# Altium schematic sheet Usb.SchDoc
size A4
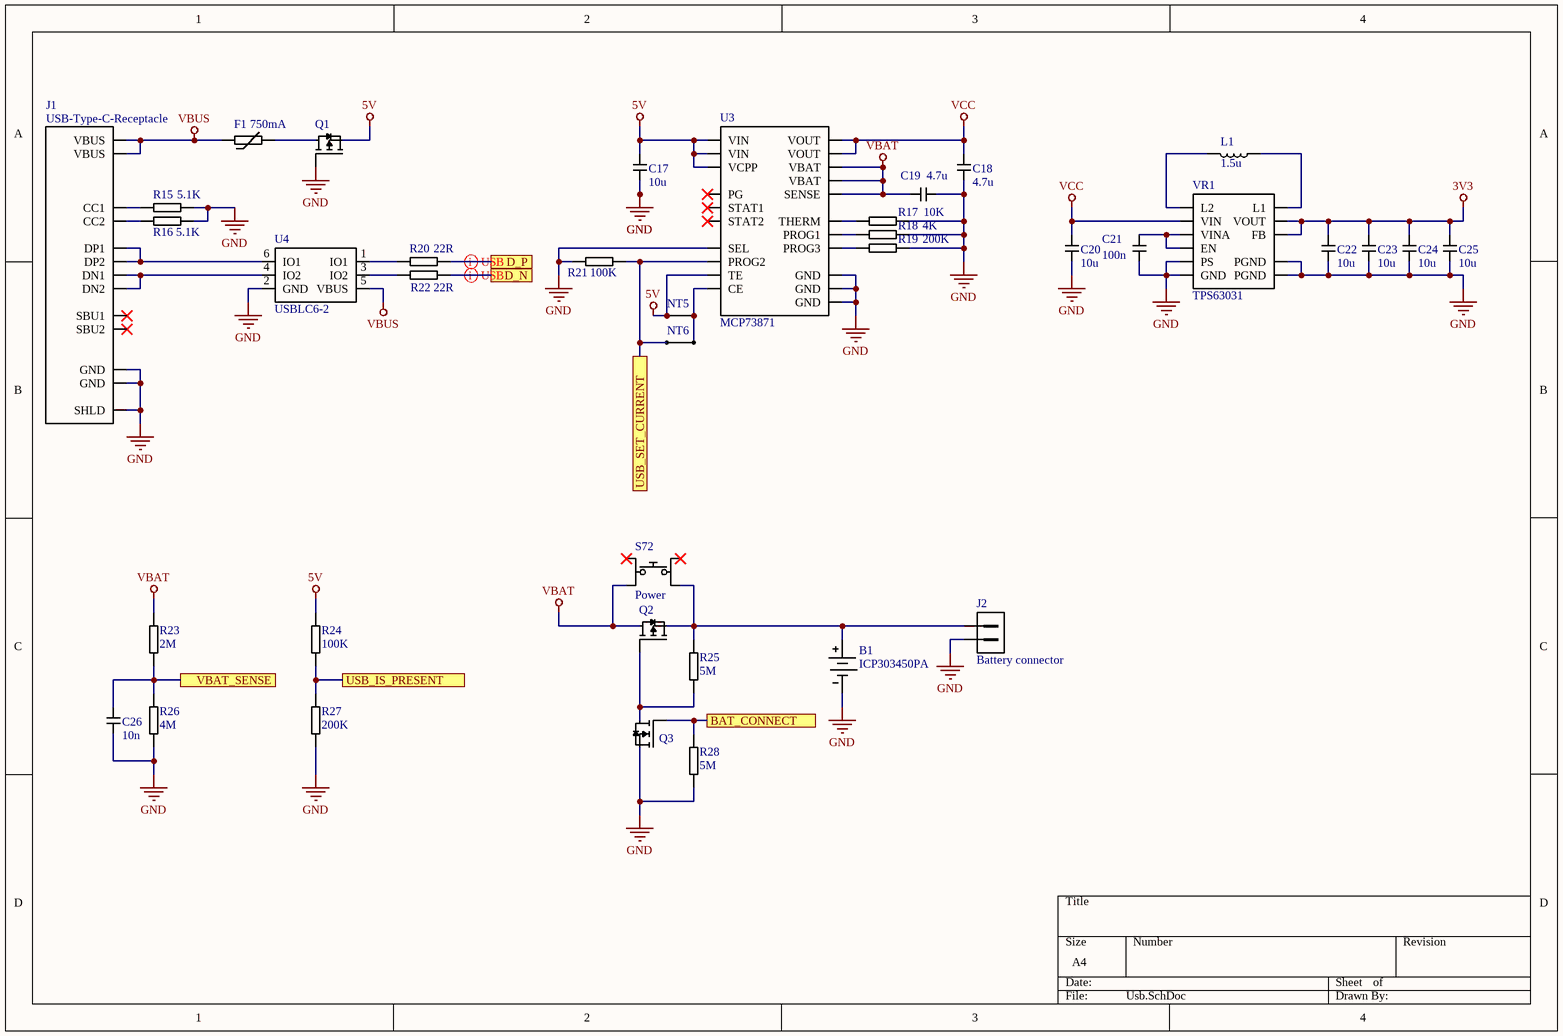
[diagram p0: Usb.SchDoc]

## Parts
B1  ICP303450PA  (mechanical)
C17  10u  [Capacitor_0603]
C18  4.7u  [Capacitor_0603]
C19  4.7u  [Capacitor_0603]
C20  10u  [Capacitor_0603]
C21  100n  [Capacitor_0603]
C22  10u  [Capacitor_0603]
C23  10u  [Capacitor_0603]
C24  10u  [Capacitor_0603]
C25  10u  [Capacitor_0603]
C26  10n  [Capacitor_0603]
F1  750mA  [Resistor_0805]
J1  USB-Type-C-Receptacle  [TYPE_C_31_M_12]
J2  Battery connector  [JST_SH_2P_Female]
L1  1.5u  [Inductor_3015]
NT5  Net tie  [Resistor_0603]  (value not drawn)  (net tie, no BOM)
NT6  Net tie  [Resistor_0603]  (value not drawn)  (net tie, no BOM)
Q1  PMOS  [SOT_233]  (value not drawn)
Q2  PMOS  [SOT_233]  (value not drawn)
Q3  NMOS  [SOT_233]  (value not drawn)
R15  5.1K  [Resistor_0603]
R16  5.1K  [Resistor_0603]
R17  10K  [Resistor_0603]
R18  4K  [Resistor_0603]
R19  200K  [Resistor_0603]
R20  22R  [Resistor_0603]
R21  100K  [Resistor_0603]
R22  22R  [Resistor_0603]
R23  2M  [Resistor_0603]
R24  100K  [Resistor_0603]
R25  5M  [Resistor_0603]
R26  4M  [Resistor_0603]
R27  200K  [Resistor_0603]
R28  5M  [Resistor_0603]
S72  Power  [Tactile_switch_5.1x5.1mm_4P]
U3  MCP73871  [QFN_20_4mm]
U4  USBLC6-2  [SOT_666]
VR1  TPS63031  [WSON_10_2.6mm]

## Ports
BAT_CONNECT, D_N, D_P, USB_IS_PRESENT, USB_SET_CURRENT, VBAT_SENSE

## Nets
3V3: C22.2 C23.2 C24.2 C25.2 VR1.1(VOUT) VR1.10(FB)
5V: C17.2 NT5.1 Q1.2 R24.2 U3.2(VCPP) U3.9(TE) U3.18(VIN) U3.19(VIN)
GND: B1.2 C17.1 C18.1 C19.2 C20.1 C21.1 C22.1 C23.1 C24.1 C25.1 C26.1 J1.A1(GND) J1.B1(GND) J1.SHLD J2.2 Q1.1 Q3.2 R15.2 R16.2 R17.2 R18.2 R19.2 R21.1 R26.1 R27.1 R28.1 U3.3(SEL) U3.10(GND) U3.11(GND) U3.21(GND) U4.2(GND) VR1.3(PGND) VR1.7(PS) VR1.9(GND) VR1.11(PGND)
VBAT: C19.1 Q2.3 R23.2 S72.4 U3.14(VBAT) U3.15(VBAT) U3.16(SENSE)
VBUS: F1.1 J1.A4(VBUS) J1.B4(VBUS) U4.5(VBUS)
VCC: C18.2 C20.2 U3.1(VOUT) U3.20(VOUT) VR1.5(VIN)
BAT_CONNECT: Q3.1 R28.2 ; port BAT_CONNECT
D_N: R22.2 ; port D_N
D_P: R20.2 ; port D_P
USB_IS_PRESENT: R24.1 R27.2 ; port USB_IS_PRESENT
USB_SET_CURRENT: NT6.1 R21.2 U3.4(PROG2) ; port USB_SET_CURRENT
VBAT_SENSE: C26.2 R23.1 R26.2 ; port VBAT_SENSE
NetB1_1: B1.1 J2.1 Q2.2 R25.2 S72.2
NetC21_2: C21.2 VR1.6(EN) VR1.8(VINA)
NetF1_2: F1.2 Q1.3
NetJ1_A5: J1.A5(CC1) R15.1
NetJ1_A6: J1.A6(DP1) J1.B6(DP2) U4.6(IO1)
NetJ1_A7: J1.A7(DN1) J1.B7(DN2) U4.4(IO2)
NetJ1_B5: J1.B5(CC2) R16.1
NetL1_1: L1.1 VR1.2(L2)
NetL1_2: L1.2 VR1.4(L1)
NetNT5_2: NT5.2 NT6.2 U3.17(CE)
NetQ2_1: Q2.1 Q3.3 R25.1
NetR17_1: R17.1 U3.5(THERM)
NetR18_1: R18.1 U3.13(PROG1)
NetR19_1: R19.1 U3.12(PROG3)
NetR20_1: R20.1 U4.1(IO1)
NetR22_1: R22.1 U4.3(IO2)

Not connected (* = marked no-connect by the designer): J1 A8(SBU1)* B8(SBU2)*; S72 1* 3*; U3 6(PG)* 7(STAT2)* 8(STAT1)*

## Layout directives
differential pair: D_N, D_P

## Notes on the sheet
- Prog1 sets max. charge current
  Prog3 sets termination point
  R(KOhm)=1000(V)/I(mA)

## Library data of the parts
B1 = Battery
C17-C26 = Capacitor
F1 = Fuse
J2 = Connector_2P
L1 = Inductor
R15-R28 = Resistor
S72 = Pushbutton_4P